# EAGLE schematic REV_1 (EAGLE 9.0.1)
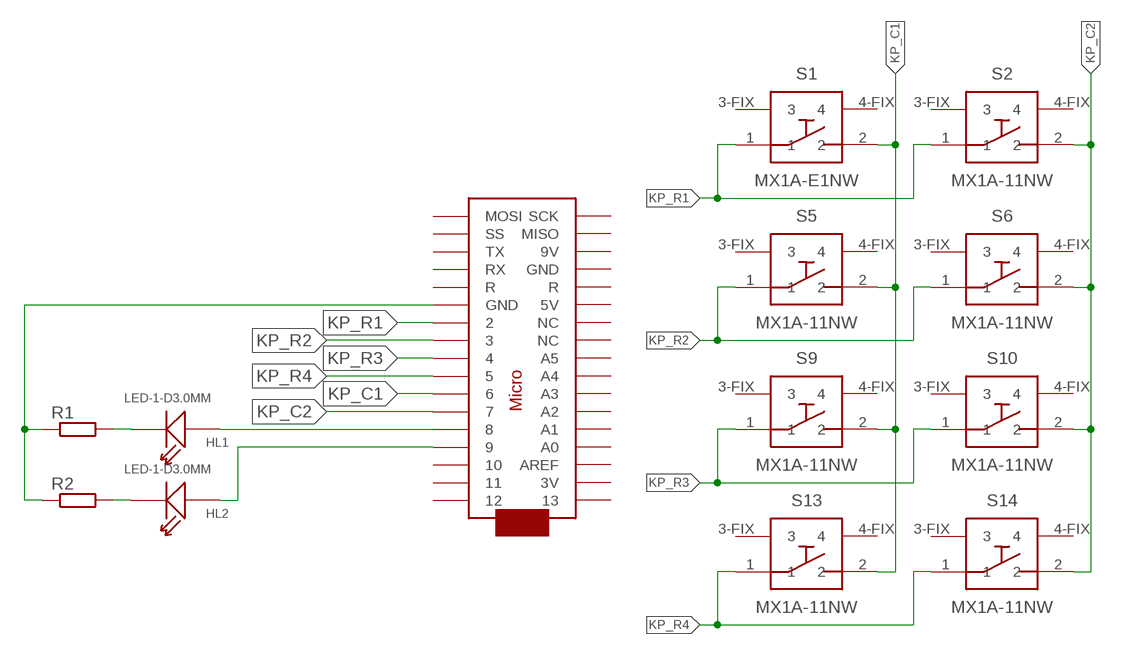
[diagram p0: schematic, sheet 1]

## Parts
HL1  LED-1-D3.0MM  [LED2-2.54-D3.0MM]
HL2  LED-1-D3.0MM  [LED2-2.54-D3.0MM]
R1  R-EU_VTA52  [VTA52]
R2  R-EU_VTA52  [VTA52]
S1  MX1A-E1NW  MX1A-11NW  [MX1A-11NW_1]
S2  MX1A-11NW  [MX1A-11NW_1]
S5  MX1A-11NW  [MX1A-11NW_1]
S6  MX1A-11NW  [MX1A-11NW_1]
S9  MX1A-11NW  [MX1A-11NW_1]
S10  MX1A-11NW  [MX1A-11NW_1]
S13  MX1A-11NW  [MX1A-11NW_1]
S14  MX1A-11NW  [MX1A-11NW_1]
U$2  ARDUINOMICRO  [ARDUINOMICRO]

## Nets
KP_C1: S1.2 S5.2 S9.2 S13.2 U$2.P$7
KP_C2: S2.2 S6.2 S10.2 S14.2 U$2.P$6
KP_R1: S1.1 S2.1 U$2.P$11
KP_R2: S5.1 S6.1 U$2.P$10
KP_R3: S9.1 S10.1 U$2.P$9
KP_R4: S13.1 S14.1 U$2.P$8
N$1: HL1.- R1.2
N$2: HL2.+ U$2.P$4
N$3: HL2.- R2.2
N$4: HL1.+ U$2.P$5
N$5: R1.1 R2.1 U$2.P$21(GND)
Unconnected: S1.3-FIX S1.4-FIX S2.3-FIX S2.4-FIX S5.3-FIX S5.4-FIX S6.3-FIX S6.4-FIX S9.3-FIX S9.4-FIX S10.3-FIX S10.4-FIX S13.3-FIX S13.4-FIX S14.3-FIX S14.4-FIX U$2.P$1 U$2.P$2 U$2.P$3 U$2.P$12(GND) U$2.P$13(R) U$2.P$14(RX) U$2.P$15(TX) U$2.P$16(SS) U$2.P$17(MOSI) U$2.P$18(SCK) U$2.P$19(MISO) U$2.P$20(9V) U$2.P$22(R) U$2.P$23(5V) U$2.P$24(NC) U$2.P$25(NC) U$2.P$26(A5) U$2.P$27(A4) U$2.P$28(A3) U$2.P$29(A2) U$2.P$30(A1) U$2.P$31(A0) U$2.P$32(AREF) U$2.P$33(3V) U$2.P$34

## Library data of the parts
HL1 HL2 = Skelet:LED-1: One Led
R1 R2 = rcl:R-EU_: RESISTOR, European symbol
S1 S2 S5 S6 S9 S10 S13 S14 = SamacSys_Parts:MX1A-11NW: CHERRY AMERICAS - MX1A-11NW - SWITCH, TACTILE, SPST-NO, 0.01A, THT <https://componentsearchengine.com/Images/1/MX1A-11NW.jpg> Source: Datasheet <http://media.digikey.com/pdf/Data Sheets/Cherry PDFs/MX Series.pdf>; DESCRIPTION: CHERRY AMERICAS - MX1A-11NW - SWITCH, TACTILE, SPST-NO, 0.01A, THT; HEIGHT: mm; MANUFACTURER_NAME: CHERRY AMERICAS; MANUFACTURER_PART_NUMBER: MX1A-11NW
U$2 = adafruit:ARDUINOMICRO